# EAGLE design BMS_Rev2_logic_B (EAGLE 6.5.0)
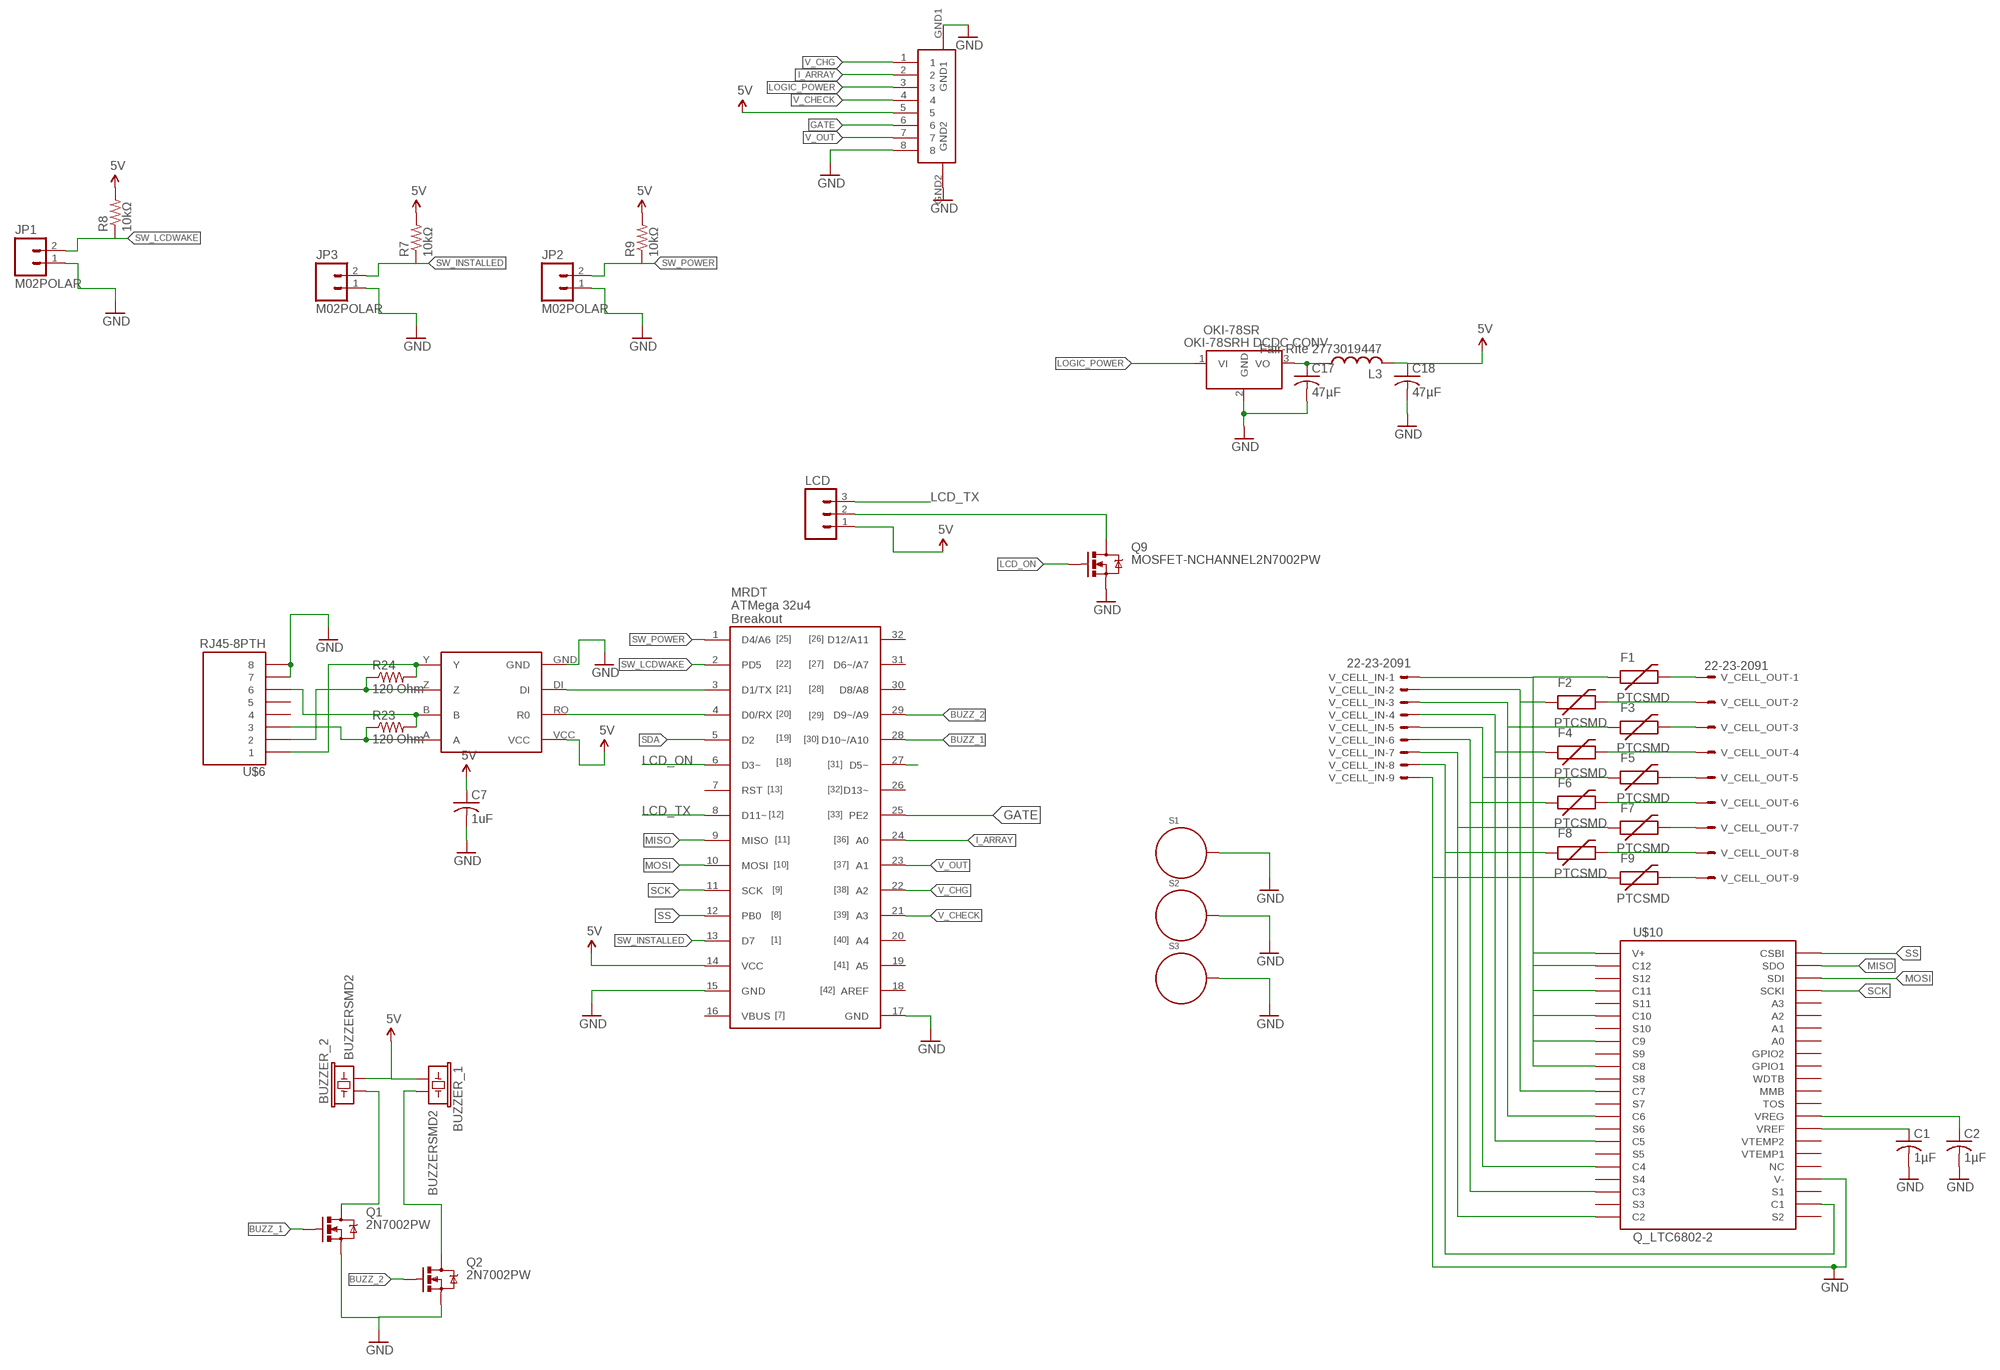
[diagram p0: schematic, sheet 1]

## Parts
BUZZER_1  BUZZERSMD2  [BUZZER-CCV]
BUZZER_2  BUZZERSMD2  [BUZZER-CCV]
C1  1µF  C-USC1206  [C1206]
C2  1µF  C-USC1206  [C1206]
C7  1uF  C-USC1206  [C1206]
C17  47µF  C-USC1206  [C1206]
C18  47µF  C-USC1206  [C1206]
F1  PTCSMD  [PTC-1206]
F2  PTCSMD  [PTC-1206]
F3  PTCSMD  [PTC-1206]
F4  PTCSMD  [PTC-1206]
F5  PTCSMD  [PTC-1206]
F6  PTCSMD  [PTC-1206]
F7  PTCSMD  [PTC-1206]
F8  PTCSMD  [PTC-1206]
F9  PTCSMD  [PTC-1206]
JP1  M02POLAR  [MOLEX-1X2]
JP2  M02POLAR  [MOLEX-1X2]
JP3  M02POLAR  [MOLEX-1X2]
L3  Fair-Rite 2773019447  L-USL4532C  [L4532M]
LCD  M03POLAR  [MOLEX-1X3]
OKI-78SR  Q_OKI-78SR  [OKI-78SRH]
Q1  2N7002PW  MOSFET-NCHANNEL2N7002PW  [SOT323]
Q2  2N7002PW  MOSFET-NCHANNEL2N7002PW  [SOT323]
Q9  MOSFET-NCHANNEL2N7002PW  [SOT323]
R7  10kΩ  R-US_R1206  [R1206]
R8  10kΩ  R-US_R1206  [R1206]
R9  10kΩ  R-US_R1206  [R1206]
R23  120 Ohm  RESISTOR1206  [1206]
R24  120 Ohm  RESISTOR1206  [1206]
S1  STANDOFF_ELECTRICAL  [STANDOFF-ELECTRICAL]
S2  STANDOFF_ELECTRICAL  [STANDOFF-ELECTRICAL]
S3  STANDOFF_ELECTRICAL  [STANDOFF-ELECTRICAL]
U$1  8POS_LOGIC  [LOGIC_CONNECT]
U$3  32U4_BREAKOUT  [32U4_MCU_DIP]
U$6  RJ45-8PTH  [RJ45-8]
U$9  MAX3077  [MAX3070E]
U$10  Q_LTC6802-2  [SSOP44]
V_CELL_IN  22-23-2091  [22-23-2091]
V_CELL_OUT  22-23-2091  [22-23-2091]

## Nets
5V: BUZZER_1.+ BUZZER_2.- C7.1 C18.1 L3.2 LCD.1 R7.2 R8.2 R9.2 U$1.5 U$3.14(VCC) U$9.VCC
BUZZ_1: Q1.1(G) U$3.28(D10~/A10)
BUZZ_2: Q2.1(G) U$3.29(D9~/A9)
GATE: U$1.6 U$3.25(PE2)
GND: C1.2 C2.2 C7.2 C17.2 C18.2 F9.1 JP1.1 JP2.1 JP3.1 OKI-78SR.2(GND) Q1.2(S) Q2.2(S) Q9.2(S) S1.P1 S2.P1 S3.P1 U$1.8 U$1.GND1 U$1.GND2 U$3.15(GND) U$3.17(GND) U$6.7 U$6.8 U$9.GND U$10.26(V-) V_CELL_IN.9
I_ARRAY: U$1.2 U$3.24(A0)
LCD_DB4: U$3.27(D5~)
LCD_ON: Q9.1(G) U$3.6(D3~)
LCD_TX: LCD.3 U$3.8(D11~)
LOGIC_POWER: OKI-78SR.1(VI) U$1.3
MISO: U$3.9(MISO) U$10.43(SDO)
MOSI: U$3.10(MOSI) U$10.42(SDI)
N$1: F1.2 V_CELL_OUT.1
N$2: F2.2 V_CELL_OUT.2
N$3: F3.2 V_CELL_OUT.3
N$4: F9.2 V_CELL_OUT.9
N$5: LCD.2 Q9.3(D)
N$6: R24.2 U$6.1 U$9.Y
N$7: R24.1 U$6.2 U$9.Z
N$8: BUZZER_1.- Q2.3(D)
N$9: R23.2 U$6.6 U$9.B
N$10: R23.1 U$6.3 U$9.A
N$11: U$3.3(D1/TX) U$9.DI
N$12: C1.1 U$10.30(VREF)
N$13: C2.1 U$10.31(VREG)
N$14: F4.2 V_CELL_OUT.4
N$15: F5.2 V_CELL_OUT.5
N$16: F6.2 V_CELL_OUT.6
N$17: F7.2 V_CELL_OUT.7
N$18: F8.2 V_CELL_OUT.8
N$19: BUZZER_2.+ Q1.3(D)
N$41: F1.1 U$10.1(V+) U$10.2(C12) U$10.4(C11) U$10.6(C10) U$10.8(C9) U$10.10(C8) V_CELL_IN.1
N$42: F2.1 U$10.12(C7) V_CELL_IN.2
N$43: F3.1 U$10.14(C6) V_CELL_IN.3
N$46: F6.1 U$10.20(C3) V_CELL_IN.6
N$47: F7.1 U$10.22(C2) V_CELL_IN.7
N$48: F8.1 U$10.24(C1) V_CELL_IN.8
N$89: F4.1 U$10.16(C5) V_CELL_IN.4
N$91: F5.1 U$10.18(C4) V_CELL_IN.5
N$100: C17.1 L3.1 OKI-78SR.3(VO)
RXD: U$3.4(D0/RX) U$9.RO(R0)
SCK: U$3.11(SCK) U$10.41(SCKI)
SDA: U$3.5(D2)
SS: U$3.12(PB0) U$10.44(CSBI)
SW_INSTALLED: JP3.2 R7.1 U$3.13(D7)
SW_LCDWAKE: JP1.2 R8.1 U$3.2(PD5)
SW_POWER: JP2.2 R9.1 U$3.1(D4/A6)
V_CHECK: U$1.4 U$3.21(A3)
V_CHG: U$1.1 U$3.22(A2)
V_OUT: U$1.7 U$3.23(A1)
Unconnected: U$3.7(RST) U$3.16(VBUS) U$3.18(AREF) U$3.19(A5) U$3.20(A4) U$3.26(D13~) U$3.30(D8/A8) U$3.31(D6~/A7) U$3.32(D12/A11) U$6.4 U$6.5 U$10.3(S12) U$10.5(S11) U$10.7(S10) U$10.9(S9) U$10.11(S8) U$10.13(S7) U$10.15(S6) U$10.17(S5) U$10.19(S4) U$10.21(S3) U$10.23(S2) U$10.25(S1) U$10.27(NC) U$10.28(VTEMP1) U$10.29(VTEMP2) U$10.32(TOS) U$10.33(MMB) U$10.34(WDTB) U$10.35(GPIO1) U$10.36(GPIO2) U$10.37(A0) U$10.38(A1) U$10.39(A2) U$10.40(A3)

## Library data of the parts
BUZZER_1 BUZZER_2 = SparkFun-Electromechanical:BUZZER: Buzzer 12mm Spark Fun Electronics SKU : Comp-Buzzer
C1 C2 C7 C17 C18 = resistor:C-US: CAPACITOR, American symbol
F1-F9 = SparkFun-PowerIC:PTC: Resettable Fuse PTC Resettable Fuse. Spark Fun Electronics SKU : COM-08357; PROD_ID: RES-11150
JP1-JP3 = SparkFun-Connectors:M02: Standard 2-pin 0.1" header. Use with - straight break away headers ( PRT-00116) - right angle break away headers (PRT-00553) - swiss pins (PRT-00743) - machine pins (PRT-00117) - female headers (PRT-00115) Molex polarized connector foot print use with: PRT-08233 with associated crimp pins and housings. 2.54_SCREWTERM for use with PRT-10571. 3.5mm Screw Terminal footprints for PRT-08084 5mm Screw Terminal footprints for use with PRT-08433
L3 = rcl:L-US: INDUCTOR, American symbol
LCD = SparkFun-Connectors:M03: Header 3 Standard 3-pin 0.1" header. Use with straight break away headers (SKU : PRT-00116), right angle break away headers (PRT-00553), swiss pins (PRT-00743), machine pins (PRT-00117), and female headers (PRT-00115). Molex polarized connector foot print use with SKU : PRT-08232 with associated crimp pins and housings.
OKI-78SR = MRDT-2015-PowerBoard:Q_OKI-78SR: 4.95W DC/DC Converter Manufacturer: Murata Part Number: OKI-78SR-5/1.5-W36H-C OKI-78SR-3.3/1.5-W36H-C
Q1 Q2 Q9 = SparkFun-DiscreteSemi:MOSFET-NCHANNEL: Common NMOSFET Parts MFG P/N Store ID Prod ID FDD8780 TRANS-09984 SI7820DN TRANS-11055 FDS6630A IC-08089 2N7002PW TRANS-11151 FQP30N06L COM-10213 TRANS-10060 BSS123LT1G TRANS-08345 BSS138 TRANS-00830 BS170 2N7000; PROD_ID: TRANS-11151
R7-R9 = resistor:R-US_: RESISTOR, American symbol
R23 R24 = SparkFun-Passives:RESISTOR: Resistor Basic schematic elements and footprints for 0603, 1206, and PTH resistors.
S1-S3 = SparkFun-Electromechanical:STANDOFF_ELECTRICAL: A standoff intended to be an electrically connected point. Pad size and stop size allow for a #4 Phillips pan screw head to make a solid connection to the board.
U$1 = New:8POS_LOGIC
U$3 = MRDT-2015-General:32U4_BREAKOUT
U$6 = SparkFun-Connectors:RJ45-8: RJ45 Jack Simple RJ45, 8-pin connection - connector for common Cat5, Cat5e, and Cat6 Ethernet cables. Footprint not yet proven in production. Connector sku is PRT-00643; Breakout PCB sku is BOB-00716.
U$9 = MAX3077:MAX3077
U$10 = MRDT-2015-BMS:Q_LTC6802-2
V_CELL_IN V_CELL_OUT = con-molex:22-23-2091: .100" (2.54mm) Center Header - 9 Pin; MF: MOLEX; MPN: 22-23-2091; OC_FARNELL: 1756827; OC_NEWARK: 56H0450

## Board
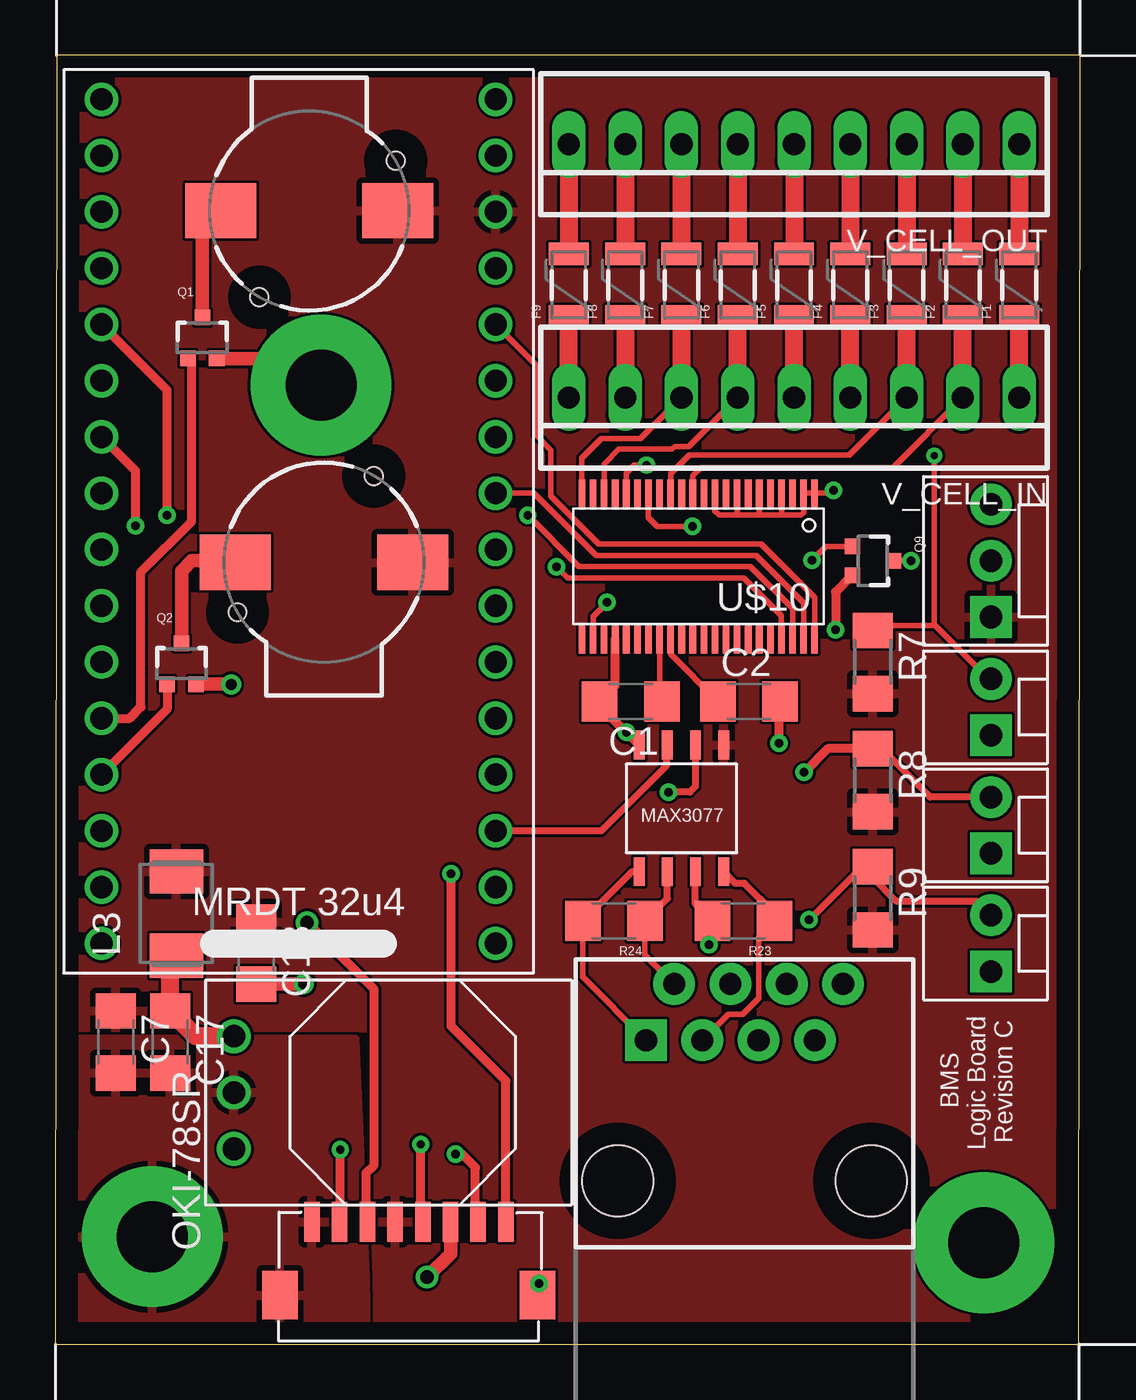
[diagram p1: board, top side]
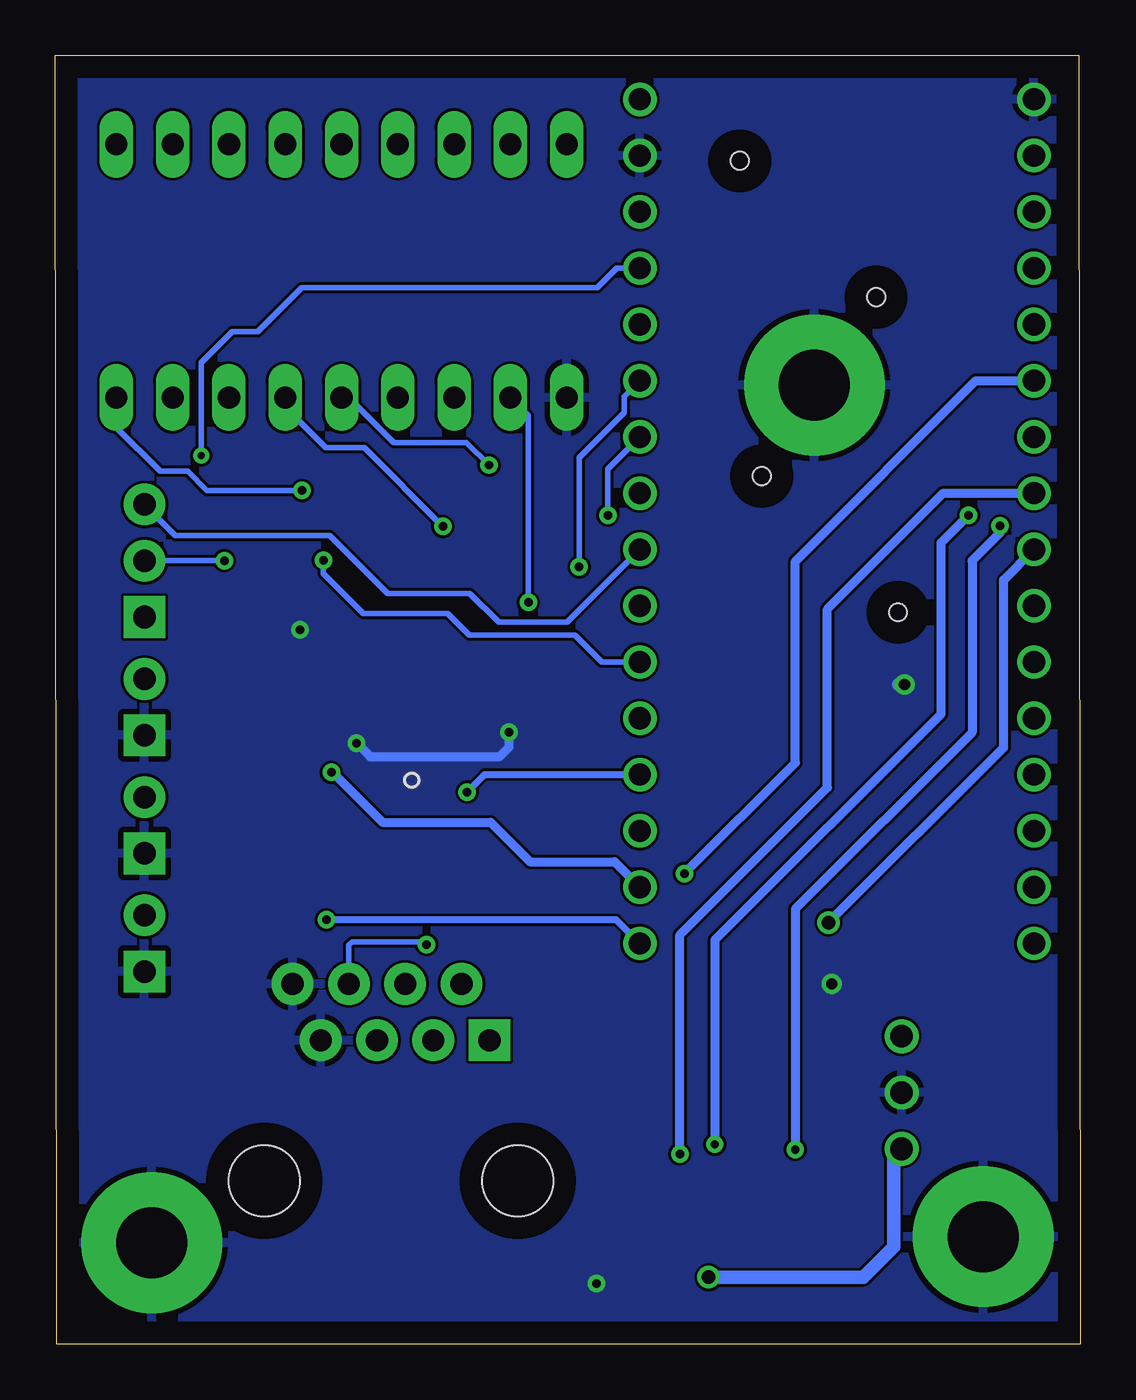
[diagram p2: board, bottom side, seen from below]

Size 46.23 x 58.17 mm. Coordinates in mm from the lower left corner, seen from the top.
Outline: 0,0 46.18,0 46.23,58.17 0.05,58.17 0,0
Copper layers (1*16): Top 0.035mm / dielectric 1.5mm / Bottom 0.035mm
Design rules "default *": minimum track width 10mil, minimum drill 10mil, track to track 5mil, track to pad 5mil, pad to pad 5mil, via to via 5mil, smd to smd 0mil, copper to edge 40mil, drill to drill 5mil, minimum pad ring 10mil, minimum via ring 8mil, stop-mask expansion 4mil, vias tented up to drill 0mil, thermal gap 10mil

### Footprints (pad centres in the part's own frame; a part is rotated, then mirrored left to right if it is on the bottom)
BUZZER-CCV = smd 3.2 x 2.5: + 4,0; - -4,0 | hole 0.8: -3.9,-2.25; 2.25,3.9
C1206 = smd 1.6 x 1.8: 1 -1.4,0; 2 1.4,0
PTC-1206 = smd 1 x 1.8: 1 -1.4,0; 2 1.4,0
MOLEX-1X2 = drill 1.016 pad 1.88 square: 1 0,0 | drill 1.016 pad 1.88: 2 2.54,0
L4532M = smd 2 x 2.4: 1 -1.9,0; 2 1.9,0
MOLEX-1X3 = drill 1.016 pad 1.88 square: 1 0,0 | drill 1.016 pad 1.88: 2 2.54,0; 3 5.08,0
OKI-78SRH = drill 1.016: 1 2.54,0; 2 0,0; 3 -2.54,0
SOT323 = smd 0.7 x 0.7: 1 -0.65,-0.925; 2 0.65,-0.925; 3 0,0.925
R1206 = smd 1.6 x 1.803: 1 -1.422,0; 2 1.422,0
1206 = smd 1.6 x 1.8: 1 -1.4,0; 2 1.4,0
STANDOFF-ELECTRICAL = drill 3.2 pad 6.35: P1 0,0
LOGIC_CONNECT = smd 0.7 x 1.8: 1 -4.375,0; 2 -3.125,0; 3 -1.875,0; 4 -0.625,0; 5 0.625,0; 6 1.875,0; 7 3.125,0; 8 4.375,0 | smd 1.6 x 2.2: GND1 -5.81,3.3; GND2 5.82,3.3
32U4_MCU_DIP = drill 1: 1 -8.89,19.05; 2 -8.89,16.51; 3 -8.89,13.97; 4 -8.89,11.43; 5 -8.89,8.89; 6 -8.89,6.35; 7 -8.89,3.81; 8 -8.89,1.27; 9 -8.89,-1.27; 10 -8.89,-3.81; 11 -8.89,-6.35; 12 -8.89,-8.89; 13 -8.89,-11.43; 14 -8.89,-13.97; 15 -8.89,-16.51; 16 -8.89,-19.05; 17 8.89,-19.05; 18 8.89,-16.51; 19 8.89,-13.97; 20 8.89,-11.43; 21 8.89,-8.89; 22 8.89,-6.35; 23 8.89,-3.81; 24 8.89,-1.27; 25 8.89,1.27; 26 8.89,3.81; 27 8.89,6.35; 28 8.89,8.89; 29 8.89,11.43; 30 8.89,13.97; 31 8.89,16.51; 32 8.89,19.05
RJ45-8 = drill 1 pad 1.88 square: 1 -4.445,6.35 | drill 1 pad 1.88: 2 -3.175,8.89; 3 -1.905,6.35; 4 -0.635,8.89; 5 0.635,6.35; 6 1.905,8.89; 7 3.175,6.35; 8 4.445,8.89 | hole 3.2: -5.715,0; 5.715,0
MAX3070E = smd 0.49 x 1.3: A -1.905,2.857; B -0.635,2.857; DI 0.635,-2.857; GND 1.905,-2.857; RO -0.635,-2.857; VCC -1.905,-2.857; Y 1.905,2.857; Z 0.635,2.857
SSOP44 = smd 0.3 x 1.25: 1 -5.25,-3.3; 2 -4.75,-3.3; 3 -4.25,-3.3; 4 -3.75,-3.3; 5 -3.25,-3.3; 6 -2.75,-3.3; 7 -2.25,-3.3; 8 -1.75,-3.3; 9 -1.25,-3.3; 10 -0.75,-3.3; 11 -0.25,-3.3; 12 0.25,-3.3; 13 0.75,-3.3; 14 1.25,-3.3; 15 1.75,-3.3; 16 2.25,-3.3; 17 2.75,-3.3; 18 3.25,-3.3; 19 3.75,-3.3; 20 4.25,-3.3; 21 4.75,-3.3; 22 5.25,-3.3; 23 5.25,3.3; 24 4.75,3.3; 25 4.25,3.3; 26 3.75,3.3; 27 3.25,3.3; 28 2.75,3.3; 29 2.25,3.3; 30 1.75,3.3; 31 1.25,3.3; 32 0.75,3.3; 33 0.25,3.3; 34 -0.25,3.3; 35 -0.75,3.3; 36 -1.25,3.3; 37 -1.75,3.3; 38 -2.25,3.3; 39 -2.75,3.3; 40 -3.25,3.3; 41 -3.75,3.3; 42 -4.25,3.3; 43 -4.75,3.3; 44 -5.25,3.3
22-23-2091 = drill 1 long: 1 -10.16,0; 2 -7.62,0; 3 -5.08,0; 4 -2.54,0; 5 0,0; 6 2.54,0; 7 5.08,0; 8 7.62,0; 9 10.16,0

### Placement (x,y rotation side)
BUZZER_1  12.12,35.28 0 top
BUZZER_2  11.46,51.16 180 top
C1  25.96,29.01 180 top
C2  31.29,29.01 0 top
C7  2.72,13.64 270 top
C17  5.18,13.64 270 top
C18  9.07,17.65 270 top
F1  43.48,47.8 90 top
F2  40.94,47.8 90 top
F3  38.4,47.8 90 top
F4  35.86,47.8 90 top
F5  33.32,47.8 90 top
F6  30.78,47.8 90 top
F7  28.24,47.8 90 top
F8  25.7,47.8 90 top
F9  23.16,47.8 90 top
JP1  42.21,22.15 90 top
JP2  42.21,16.81 90 top
JP3  42.21,27.48 90 top
L3  5.46,19.43 90 top
LCD  42.21,32.82 90 top
OKI-78SR  8.05,11.35 270 top
Q1  6.63,45.42 0 top
Q2  5.69,30.71 0 top
Q9  36.88,35.36 270 top
R7  36.88,30.78 270 top
R8  36.88,25.45 270 top
R9  36.88,20.12 270 top
R23  31.04,19.1 180 top
R24  25.2,19.1 180 top
S1  41.88,4.57 0 top
S2  4.37,4.85 0 top
S3  11.99,43.28 0 top
U$1  15.95,5.51 180 top
U$3  10.97,37.13 180 top
U$6  31.09,7.37 0 top
U$9  28.24,24.18 180 top
U$10  29.01,35.1 180 top
V_CELL_IN  33.32,42.72 180 top
V_CELL_OUT  33.32,54.15 180 top

### Tracks (layer width: path | path; a pad name or v marks a point on that pad's centre or on a via)
5V
  pour Top (rank 2): -25.6,80.31 -25.6,-15.95 105.21,-15.95 105.21,80.31
BUZZ_1
  Top 0.406: U$3.28 3.35,28.24 3.86,28.75 3.86,34.85 6.15,37.13 6.15,44.32 Q1.1
BUZZ_2
  Top 0.406: Q2.1 5.04,28.66 U$3.29
GATE  (via drill 0.6)
  Top 0.406: v11.35,19.02 14.37,16 14.37,8.08 14.02,7.72 14.02,5.57 U$1.6
  Bottom 0.406: v11.35,19.02 3.45,26.92 3.45,34.49 U$3.25
GND  (via drill 0.38, 0.5)
  Top 0.254: 25.26,29.7 C1.2
  Top 0.406: U$9.GND v25.76,27.62 24.56,28.82 C1.2 | 25.26,29.7 U$10.26 | C2.2 32.64,28.95 v32.64,27.13 | Q9.2 35.2,33.96 v35.2,32.23 | U$1.GND1 21.82,2.21 v21.82,2.74
  Top 0.61: Q2.2 7.91,29.78 v7.92,29.77 | Q1.2 10.78,44.49 S3.P1 | C18.2 v11.2,16.26
  Top 0.813: V_CELL_IN.9 F9.1
  Bottom 0.406: v32.64,27.13 32.03,26.52 26.19,26.52 25.76,26.94 v25.76,27.62 | v35.2,32.23 35.05,32.08
  Bottom 0.61: v7.92,29.77 8.18,29.77
  pour Bottom: -33.48,73.71 -33.48,-8.59 71.17,-8.59 71.17,73.71
  pour Top: -3.61,13.77 13.51,13.77 13.97,2.95 14.1,-3.56 -3.61,-3.43
I_ARRAY  (via drill 0.38)
  Top 0.406: U$1.2 18.95,5.64 18.95,7.98 18.34,8.58 v18.06,8.58
  Bottom 0.406: U$3.24 6.17,38.4 11.4,33.17 11.4,25.12 18.06,18.47 v18.06,8.58
LCD_ON  (via drill 0.38)
  Top 0.254: Q9.1 34.76,36.01 v34.14,35.38
  Bottom 0.254: v34.14,35.38 34.14,34.77 32.33,32.97 28.52,32.97 27.56,32 22.81,32 21.59,30.78 U$3.6
LCD_TX
  Bottom 0.254: U$3.8 23.14,32.59 26.24,32.59 27.53,33.88 31.24,33.88 33.86,36.5 40.82,36.5 LCD.3
LOGIC_POWER  (via drill 0.6)
  Top 0.61: v16.76,3.02 17.83,4.08 U$1.3
  Bottom 0.61: v16.76,3.02 9.78,3.02 8.41,4.39 8.41,8.46 OKI-78SR.1
MISO
  Top 0.254: U$10.43 33.76,33.45 31.62,35.59 24.41,35.59 21.59,38.4 U$3.9
MOSI  (via drill 0.38)
  Top 0.254: U$10.42 33.26,33.19 31.34,35.1 23.62,35.1 v21.31,37.41
  Bottom 0.254: v21.31,37.41 21.31,39.5 U$3.10
N$1
  Top 0.813: V_CELL_OUT.1 F1.2
N$2
  Top 0.813: V_CELL_OUT.2 F2.2
N$3
  Top 0.813: V_CELL_OUT.3 F3.2
N$4
  Top 0.813: V_CELL_OUT.9 F9.2
N$5  (via drill 0.38)
  Top 0.254: Q9.3 v38.61,35.36
  Bottom 0.254: v38.61,35.36 LCD.2
N$6
  Top 0.254: R24.2 23.8,16.56 U$6.1
  Top 0.305: R24.2 26.02,21.32 U$9.Y
N$7
  Top 0.254: U$6.2 26.6,17.57 R24.1
  Top 0.305: R24.1 27.61,20.11 U$9.Z
N$8
  Top 0.61: Q2.3 5.69,34.9 6.15,35.36 8.04,35.36 BUZZER_1.-
N$9  (via drill 0.38)
  Top 0.254: v29.49,18.03 29.49,18.95 R23.2
  Top 0.305: R23.2 28.88,19.86 U$9.B
  Bottom 0.254: U$6.6 32.99,18.01 32.84,18.16 29.62,18.16 v29.49,18.03
N$10
  Top 0.254: U$6.3 30.35,14.88 31.01,14.88 31.72,15.6 31.72,18.39 R23.1
  Top 0.305: 31.93,18.59 R23.1 32.44,19.45 31.09,20.8 30.67,20.8 U$9.A
N$11
  Top 0.305: U$9.DI 27.56,26.99 27.56,26.09 24.64,23.16 U$3.3
N$12
  Top 0.254: U$10.30 27.26,29.11 C1.1
N$13
  Top 0.254: U$10.31 27.76,31.14 C2.1
N$14
  Top 0.813: V_CELL_OUT.4 F4.2
N$15
  Top 0.813: V_CELL_OUT.5 F5.2
N$16
  Top 0.813: V_CELL_OUT.6 F6.2
N$17
  Top 0.813: V_CELL_OUT.7 F7.2
N$18
  Top 0.813: V_CELL_OUT.8 F8.2
N$19
  Top 0.61: Q1.3 6.63,50.33 BUZZER_2.+
N$41  (via drill 0.38)
  Top 0.254: 32.77,37.41 33.63,37.41 33.76,37.54 U$10.2 U$10.1 34.97,38.4 v35.1,38.53 | 32.77,37.41 31.75,37.41 | 31.75,37.41 30.76,37.41 | 30.76,37.41 29.95,37.41 29.76,37.6 U$10.10 | U$10.8 30.76,37.41 | U$10.6 31.75,38.34 31.75,37.41 | U$10.4 32.77,38.34 32.77,37.41
  Top 0.813: V_CELL_IN.1 F1.1
  Bottom 0.254: V_CELL_IN.1 43.48,41.38 41.5,39.4 40.26,39.4 39.4,38.53 v35.1,38.53
N$42
  Top 0.254: U$10.12 28.76,39.2 29.13,39.57 37.79,39.57 V_CELL_IN.2
  Top 0.813: V_CELL_IN.2 F2.1
N$43
  Top 0.254: U$10.14 27.76,39.29 28.6,40.13 35.81,40.13 V_CELL_IN.3
  Top 0.813: V_CELL_IN.3 F3.1
N$46
  Top 0.254: 30.71,42.72 V_CELL_IN.6 28.57,40.51 27.94,40.51 27.81,40.39 25.43,40.39 24.76,39.73 U$10.20
  Top 0.813: V_CELL_IN.6 F6.1
N$47
  Top 0.254: V_CELL_IN.7 26.39,40.87 24.64,40.87 23.76,39.99 U$10.22
  Top 0.813: F7.1 V_CELL_IN.7
N$48  (via drill 0.38)
  Top 0.254: U$10.24 24.26,32.84 v24.89,33.48
  Top 0.813: F8.1 V_CELL_IN.8
  Bottom 0.254: v24.89,33.48 24.89,41.91 V_CELL_IN.8
N$89  (via drill 0.38)
  Top 0.254: U$10.16 26.75,38.39 26.75,37.31 27.15,36.91 v28.75,36.91
  Top 0.813: V_CELL_IN.4 F4.1
  Bottom 0.254: v28.75,36.91 32.31,40.46 34.04,40.46 35.86,42.29 V_CELL_IN.4
N$91  (via drill 0.38)
  Top 0.254: U$10.18 25.76,39.32 26.11,39.67 v26.67,39.67
  Top 0.813: V_CELL_IN.5 F5.1
  Bottom 0.254: v26.67,39.67 27.69,40.69 30.96,40.69 32.99,42.72 V_CELL_IN.5
N$100
  Top 0.813: L3.1 5.18,17.27 C17.1 6.33,13.89 OKI-78SR.3
RXD  (via drill 0.38)
  Top 0.305: U$9.RO 28.88,25.17 28.63,24.92 v27.66,24.92
  Bottom 0.305: v27.66,24.92 26.87,25.7 U$3.4
SCK  (via drill 0.38)
  Top 0.254: U$10.41 32.76,32.88 31.06,34.57 23.11,34.57 v22.61,35.08
  Bottom 0.254: v22.61,35.08 22.61,40 20.57,42.04 20.57,42.77 U$3.11
SS
  Top 0.254: U$10.44 34.26,33.71 31.85,36.12 24.51,36.12 22.35,38.28 22.35,40.36 21.69,41.02 21.69,44.2 U$3.12
SW_INSTALLED  (via drill 0.33)
  Top 0.254: 37.11,32.44 R7.1 37.11,32.44 | v39.65,40.11 39.65,32.44 | 37.11,32.44 39.22,32.44 39.65,32.44 | JP3.2 42.11,30.02 39.7,32.44 39.65,32.44
  Bottom 0.254: U$3.13 20.9,48.56 21.79,47.68 35.13,47.68 37.11,45.69 38.25,45.69 39.65,44.3 v39.65,40.11
SW_LCDWAKE  (via drill 0.38)
  Top 0.305: JP1.2 39.47,24.69 37.29,26.87 R8.1
  Top 0.406: R8.1 34.85,26.87 v33.78,25.81
  Bottom 0.406: v33.78,25.81 33.73,25.81 31.47,23.55 26.59,23.55 24.82,21.77 21.01,21.77 U$3.2
SW_POWER  (via drill 0.38)
  Top 0.305: v34.01,19.15 36.4,21.54 R9.1 36.88,21.06 37.95,19.99 41.58,19.99 JP2.2
  Bottom 0.305: U$3.1 20.93,19.15 v34.01,19.15
V_CHECK  (via drill 0.38)
  Top 0.406: U$3.21 5.03,43.08 v5.03,37.41 | 16.37,8.91 v16.48,9.02 16.48,5.6 U$1.4
  Bottom 0.406: v16.48,9.02 16.48,18.24 6.27,28.45 6.27,36.17 v5.03,37.41
V_CHG  (via drill 0.38)
  Top 0.406: v17.86,21.23 17.86,14.35 20.33,11.88 U$1.1
  Bottom 0.406: v17.86,21.23 12.85,26.24 12.85,35.33 4.7,43.48 U$3.22
V_OUT  (via drill 0.38)
  Top 0.406: U$3.23 3.61,39.42 v3.61,36.93 | U$1.7 12.85,5.54 v12.85,8.79
  Bottom 0.406: v3.61,36.93 3.61,36.63 4.88,35.36 4.88,27.61 12.85,19.63 v12.85,8.79

### Text on the board
tPlace: BMS / Logic Board / Revision C